# EAGLE design sensor (EAGLE 6.5.0)
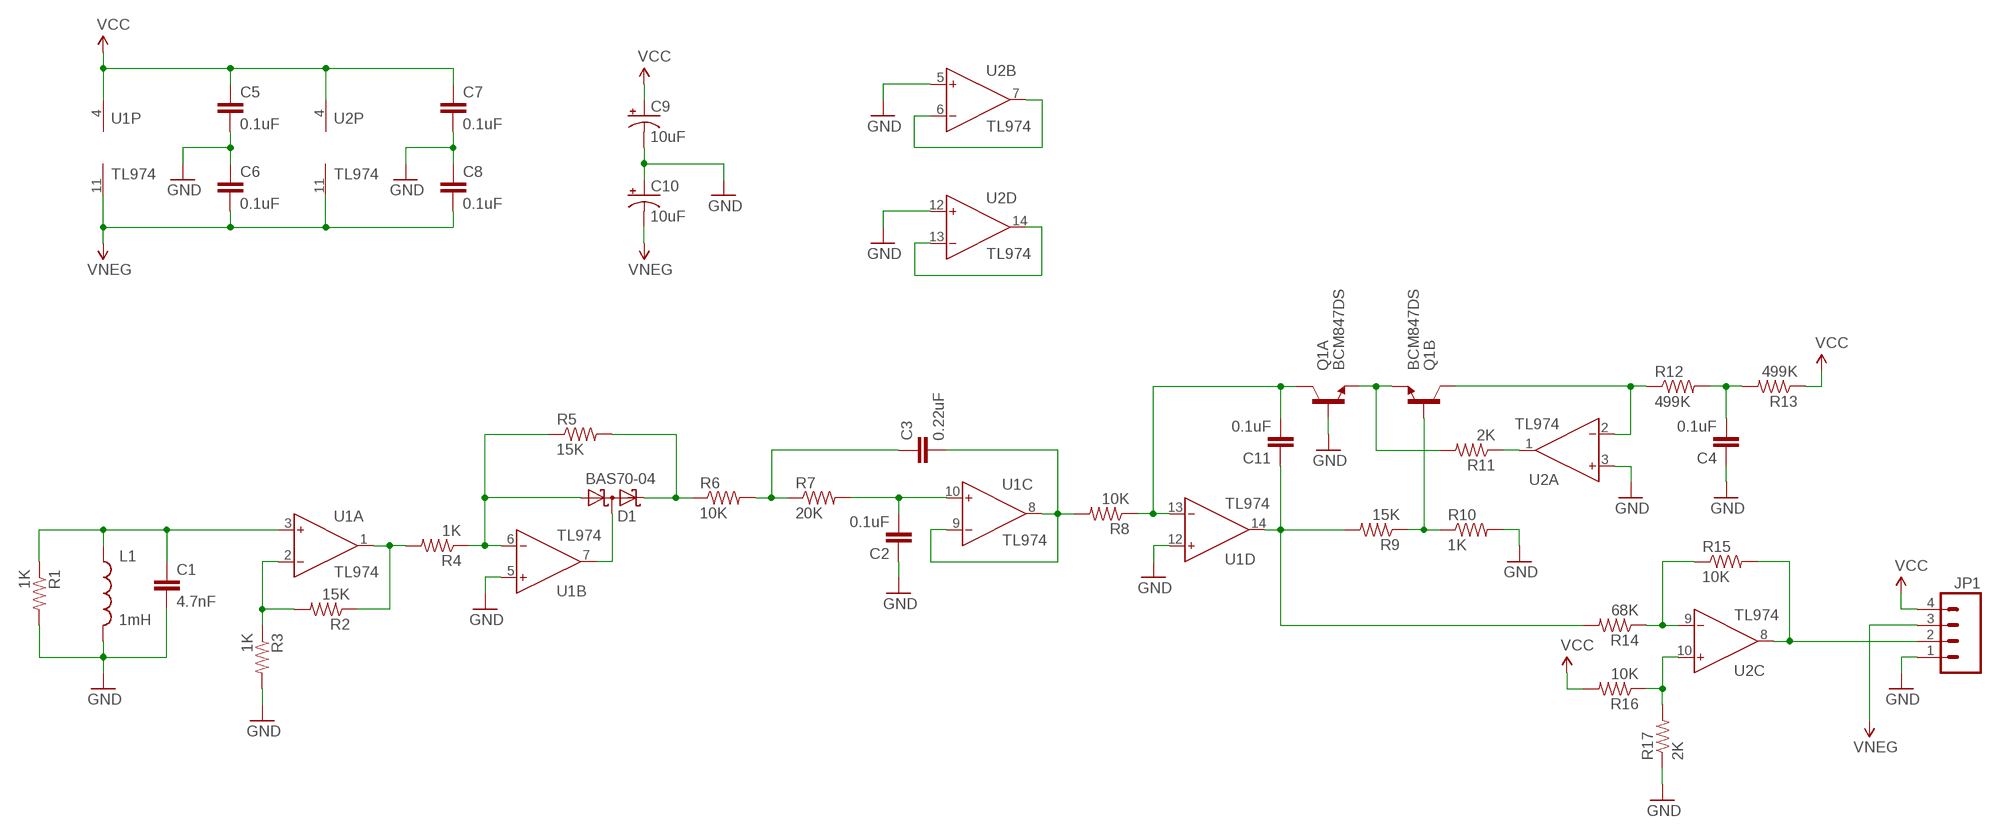
[diagram p0: schematic, sheet 1]

## Parts
C1  4.7nF  CAP0805  [0805]
C2  0.1uF  CAP0805  [0805]
C3  0.22uF  CAP0805  [0805]
C4  0.1uF  CAP0805  [0805]
C5  0.1uF  CAP0805  [0805]
C6  0.1uF  CAP0805  [0805]
C7  0.1uF  CAP0805  [0805]
C8  0.1uF  CAP0805  [0805]
C9  10uF  CPOL-USE2-4  [E2-4]
C10  10uF  CPOL-USE2-4  [E2-4]
C11  0.1uF  CAP0805  [0805]
D1  BAS70-04  [SOT23]
JP1  M04POLAR_LOCK  [MOLEX-1X4_LOCK]
L1  1mH  INDUCTORRLB0912  [RLB0912]
Q1  BCM847DS  [SOT-457]
R1  1K  RESISTOR0805-RES  [0805]
R2  15K  RESISTOR0805-RES  [0805]
R3  1K  RESISTOR0805-RES  [0805]
R4  1K  RESISTOR0805-RES  [0805]
R5  15K  RESISTOR0805-RES  [0805]
R6  10K  RESISTOR0805-RES  [0805]
R7  20K  RESISTOR0805-RES  [0805]
R8  10K  RESISTOR0805-RES  [0805]
R9  15K  RESISTOR0805-RES  [0805]
R10  1K  RESISTOR0805-RES  [0805]
R11  2K  RESISTOR0805-RES  [0805]
R12  499K  RESISTOR0805-RES  [0805]
R13  499K  RESISTOR0805-RES  [0805]
R14  68K  RESISTOR0805-RES  [0805]
R15  10K  RESISTOR0805-RES  [0805]
R16  10K  RESISTOR0805-RES  [0805]
R17  2K  RESISTOR0805-RES  [0805]
U1  TL974  [SOIC-14]
U2  TL974  [SOIC-14]

## Nets
GND: C1.2 C2.1 C4.1 C5.2 C6.1 C7.2 C8.1 C9.- C10.+ JP1.1 L1.2 Q1.2(A:B) R1.2 R3.2 R10.2 R17.1 U1.5(B:IN+) U1.12(D:IN+) U2.3(A:IN+) U2.5(B:IN+) U2.12(D:IN+)
N$1: C1.1 L1.1 R1.1 U1.3(A:IN+)
N$2: D1.1(A1) R4.1 R5.1 U1.6(B:IN-)
N$3: R2.2 R3.1 U1.2(A:IN-)
N$4: R2.1 R4.2 U1.1(A:OUT)
N$5: D1.2(C2) R5.2 R6.1
N$6: C2.2 R7.2 U1.10(C:IN+)
N$7: C3.1 R6.2 R7.1
N$8: D1.3(C1A2) U1.7(B:OUT)
N$9: U2.6(B:IN-) U2.7(B:OUT)
N$10: C3.2 R8.2 U1.8(C:OUT) U1.9(C:IN-)
N$11: U2.13(D:IN-) U2.14(D:OUT)
N$13: C11.2 Q1.6(A:C) R8.1 U1.13(D:IN-)
N$14: R11.1 U2.1(A:OUT)
N$15: Q1.1(A:E) Q1.4(B:E) R11.2
N$16: Q1.5(B:B) R9.1 R10.1
N$17: C11.1 R9.2 R14.2 U1.14(D:OUT)
N$18: C4.2 R12.2 R13.2
N$19: Q1.3(B:C) R12.1 U2.2(A:IN-)
N$20: R16.1 R17.2 U2.10(C:IN+)
N$22: R14.1 R15.1 U2.9(C:IN-)
N$24: JP1.2 R15.2 U2.8(C:OUT)
VCC: C5.1 C7.1 C9.+ JP1.4 R13.1 R16.2 U1.4(P:V+) U2.4(P:V+)
VNEG: C6.2 C8.2 C10.- JP1.3 U1.11(P:V-) U2.11(P:V-)

## Library data of the parts
C1-C8 C11 = SparkFun-Capacitors:CAP: Capacitor Standard 0603 ceramic capacitor, and 0.1" leaded capacitor.
C9 C10 = resistor:CPOL-US: POLARIZED CAPACITOR, American symbol
D1 = diode:BAS70-04: Silicon Schottky Diodes General-purpose diode for high-speed switching
JP1 = SparkFun-Connectors:M04: Header 4 Standard 4-pin 0.1" header. Use with straight break away headers (SKU : PRT-00116), right angle break away headers (PRT-00553), swiss pins (PRT-00743), machine pins (PRT-00117), and female headers (PRT-00115). Molex polarized connector foot print use with SKU : PRT-08231 with associated crimp pins and housings. 1MM SMD Version SKU: PRT-10208
L1 = SparkFun-Passives:INDUCTOR: Inductors Basic Inductor/Choke - 0603 and 1206. Footprints are not proven and vary greatly between part numbers. SRN6045- 33uH, 20% 1.4A SDR0403-560KL - 56uH, 10%, 500mA RMS/740mA peak
Q1 = Custom:BCM847DS: NPN/NPN matched double transistors
R1-R17 = SparkFun-Resistors:RESISTOR: Resistor Basic schematic elements and footprints for 0603, 1206, and PTH resistors.
U1 U2 = Custom:TL974: Quad Rail-to-Rail Very-Low-Noise Op Amp

## Board
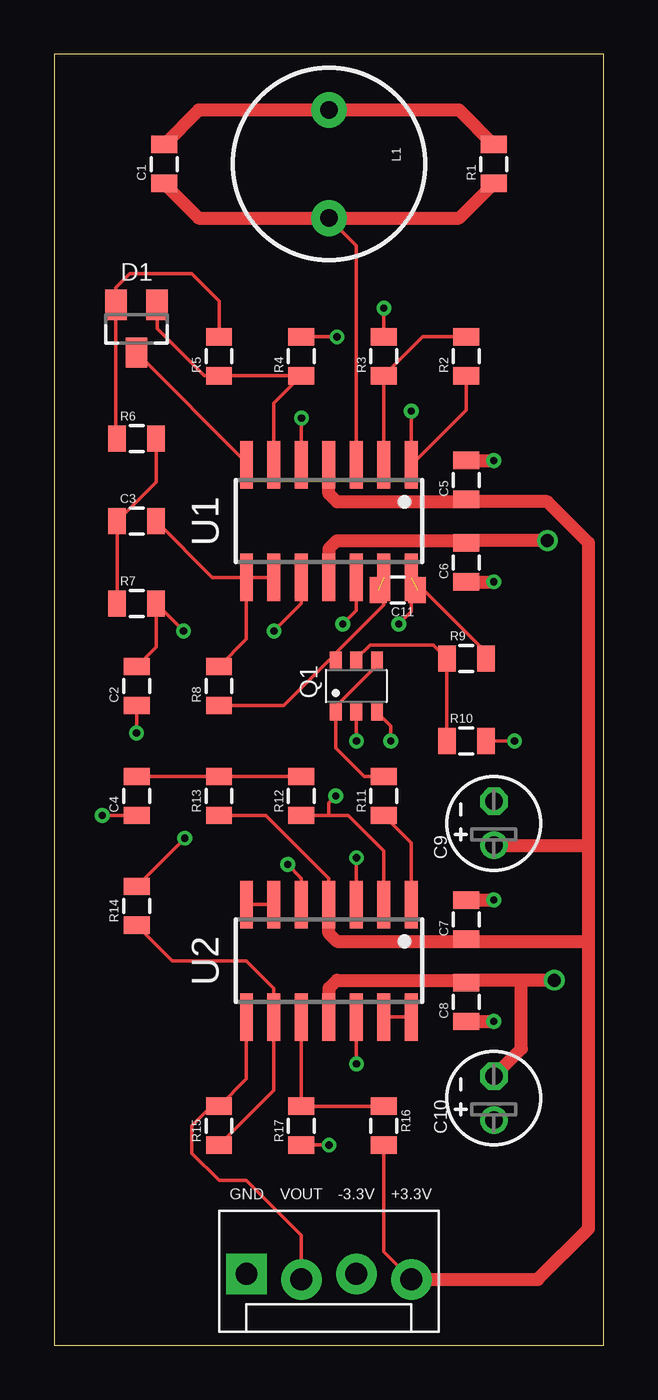
[diagram p1: board, top side]
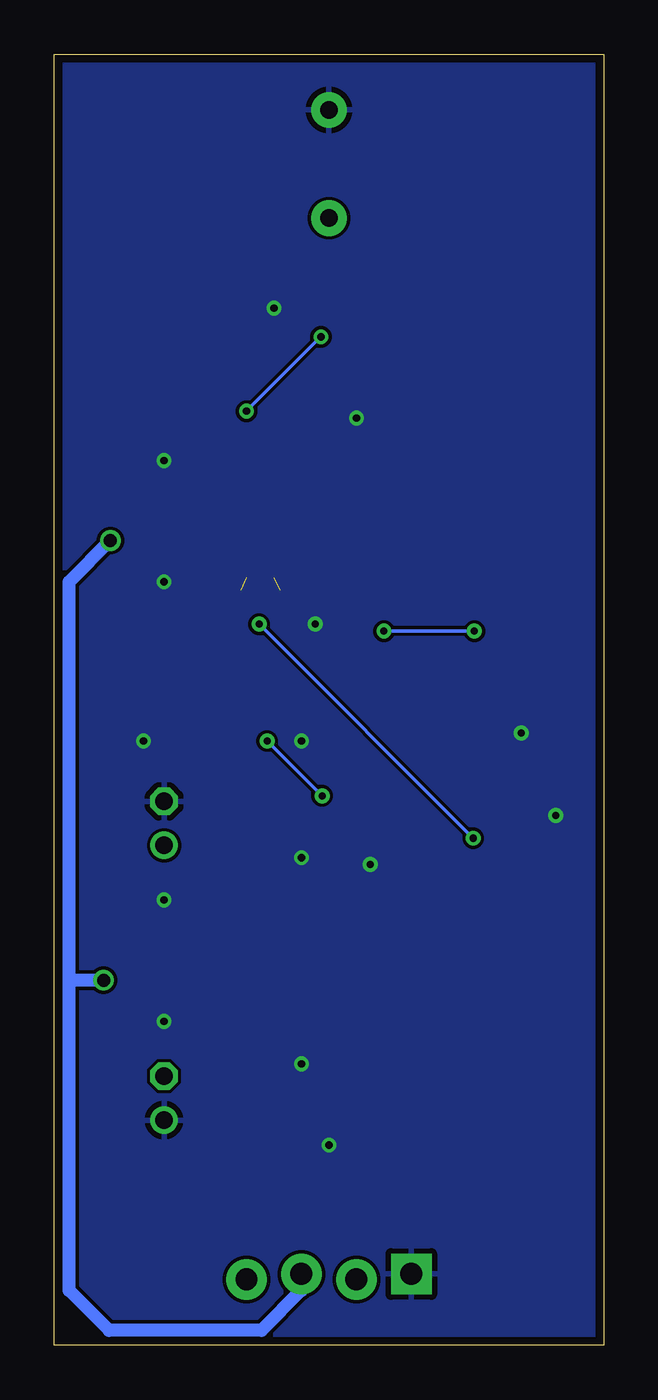
[diagram p2: board, bottom side, seen from below]

Size 25.4 x 59.69 mm. Coordinates in mm from the lower left corner, seen from the top.
Outline: 0,0 25.4,0 25.4,59.69 0,59.69 0,0
Copper layers (1*16): Top 0.0356mm / dielectric 1.5011mm / Bottom 0.0356mm
Design rules "LaenPCBOrder": minimum track width 6mil, minimum drill 13mil, track to track 6mil, track to pad 6mil, pad to pad 6mil, via to via 6mil, smd to smd 6mil, copper to edge 15mil, drill to drill 6mil, minimum pad ring 7mil, minimum via ring 7mil, stop-mask expansion 3mil, vias tented up to drill 0mil, thermal gap 10mil

### Footprints (pad centres in the part's own frame; a part is rotated, then mirrored left to right if it is on the bottom)
0805 = smd 0.8 x 1.2: 1 -0.9,0; 2 0.9,0
E2-4 = drill 0.813 pad 1.27: + -1.016,0 | drill 0.813 pad 1.27 octagon: - 1.016,0
SOT23 = smd 1 x 1.4: 1 -0.95,-1.1; 2 0.95,-1.1; 3 0,1.1
MOLEX-1X4_LOCK = drill 1.016 pad 1.88 square: 1 0,0.127 | drill 1.016 pad 1.88: 2 2.54,-0.127; 3 5.08,0.127; 4 7.62,-0.127
RLB0912 = drill 0.813 pad 1.651: 1 2.502,0; 2 -2.502,0
SOT-457 = smd 0.55 x 0.8: 1 -0.95,-1.2; 2 0,-1.2; 3 0.95,-1.2; 4 0.95,1.2; 5 0,1.2; 6 -0.95,1.2
SOIC-14 = smd 0.6 x 2.2: 1 -3.81,-2.6; 2 -2.54,-2.6; 3 -1.27,-2.6; 4 0,-2.6; 5 1.27,-2.6; 6 2.54,-2.6; 7 3.81,-2.6; 8 3.81,2.6; 9 2.54,2.6; 10 1.27,2.6; 11 0,2.6; 12 -1.27,2.6; 13 -2.54,2.6; 14 -3.81,2.6

### Placement (x,y rotation side)
C1  5.08,54.61 90 top
C2  3.81,30.48 90 top
C3  3.81,38.1 0 top
C4  3.81,25.4 90 top
C5  19.05,40.01 90 top
C6  19.05,36.2 90 top
C7  19.05,19.68 90 top
C8  19.05,15.88 90 top
C9  20.32,24.13 90 top
C10  20.32,11.43 90 top
C11  15.88,34.92 180 top
D1  3.81,46.99 180 top
JP1  8.89,3.17 0 top
L1  12.7,54.61 270 top
Q1  13.97,30.48 0 top
R1  20.32,54.61 90 top
R2  19.05,45.72 90 top
R3  15.24,45.72 90 top
R4  11.43,45.72 90 top
R5  7.62,45.72 90 top
R6  3.81,41.91 0 top
R7  3.81,34.29 0 top
R8  7.62,30.48 90 top
R9  19.05,31.75 0 top
R10  19.05,27.94 0 top
R11  15.24,25.4 90 top
R12  11.43,25.4 90 top
R13  7.62,25.4 90 top
R14  3.81,20.32 90 top
R15  7.62,10.16 90 top
R16  15.24,10.16 270 top
R17  11.43,10.16 90 top
U1  12.7,38.1 180 top
U2  12.7,17.78 180 top

### Tracks (layer width: path | path; a pad name or v marks a point on that pad's centre or on a via)
GND  (via drill 0.33)
  Top 0.152: R3.2 v15.24,47.94 | U1.5 v11.43,42.86 | C2.1 v3.81,28.31 | Q1.2 v13.97,27.94 | C4.1 v2.22,24.5 | U2.3 v13.97,22.54 | R17.1 v12.7,9.26 | U1.12 13.97,33.97 v13.34,33.34 | U2.12 v13.97,13.02 | U2.5 11.43,21.59 v10.79,22.23 | R10.2 v21.27,27.94
  Top 0.61: C1.2 6.68,57.11 L1.2 18.72,57.11 R1.2 | C5.2 v20.32,40.91 | C6.1 v20.32,35.3 | C7.2 v20.32,20.59 | C8.1 v20.32,14.97
  pour Bottom: 0,0 25.4,0 25.4,59.69 0,59.69
N$1
  Top 0.152: L1.1 13.97,50.84 U1.3
  Top 0.61: C1.1 6.68,52.11 L1.1 18.72,52.11 R1.1
N$2
  Top 0.152: U1.6 10.16,43.55 R4.1 R5.1 6.93,44.82 4.76,46.99 D1.1
N$3
  Top 0.152: U1.2 R3.1 17.04,46.62 R2.2
N$4  (via drill 0.33)
  Top 0.152: v16.51,43.18 U1.1 19.05,43.24 R2.1 | v13.07,46.62 R4.2
  Bottom 0.152: v16.51,43.18 v13.07,46.62
N$5
  Top 0.152: R6.1 2.86,41.96 D1.2 2.86,48.9 3.49,49.53 6.35,49.53 7.62,48.26 R5.2
N$6  (via drill 0.33)
  Top 0.152: C2.2 4.71,32.28 R7.2 v5.98,33.02 | v10.16,33.02 11.43,34.29 U1.10
  Bottom 0.152: v5.98,33.02 v10.16,33.02
N$7
  Top 0.152: R6.2 4.71,39.9 C3.1 R7.1
N$8
  Top 0.152: 3.7,45.89 D1.3 8.89,40.81 U1.7
N$9
  Top 0.152: U2.7 U2.6
N$10
  Top 0.152: C3.2 7.31,35.5 U1.8 | U1.8 U1.9 | R8.2 8.89,32.65 U1.8
N$11
  Top 0.152: U2.13 U2.14
N$13  (1 unrouted)
  Top 0.152: R8.1 10.6,29.58 12.7,31.68 Q1.6 13.02,32 15.24,34.22 U1.13
N$14
  Top 0.152: R11.1 16.51,23.23 U2.1
N$15
  Top 0.152: R11.2 14.34,26.3 13.02,27.62 Q1.1 13.02,29.53 14.92,31.43 Q1.4
N$16
  Top 0.152: Q1.5 13.97,31.75 14.61,32.38 17.52,32.38 R9.1 R10.1
N$17  (via drill 0.33)  (1 unrouted)
  Top 0.152: R9.2 19.95,32.06 U1.14 16.51,33.92 v15.93,33.34 | v6.03,23.44 R14.2
  Bottom 0.152: v15.93,33.34 v6.03,23.44
N$18
  Top 0.152: R12.2 R13.2 C4.2
N$19  (via drill 0.33)
  Top 0.152: R12.1 12.7,24.5 | 12.7,24.5 13.6,24.5 15.24,22.86 U2.2 | Q1.3 15.56,28.64 v15.56,27.94 | v13.02,25.4 12.7,25.08 12.7,24.5
  Bottom 0.152: v15.56,27.94 v13.02,25.4
N$20
  Top 0.152: R16.1 R17.2 U2.10
N$22
  Top 0.152: R14.1 5.45,17.78 8.89,17.78 10.16,16.51 U2.9 10.16,11.8 R15.1
N$24
  Top 0.152: JP1.2 11.43,5.08 8.89,7.62 7.62,7.62 6.35,8.89 6.35,10.16 7.25,11.06 R15.2 8.89,12.33 U2.8
VCC
  Top 0.152: R13.1 9.79,24.5 12.7,21.59 U2.4 | R16.2 15.24,4.32 JP1.4
  Top 0.61: 24.7,18.68 24.7,5.4 22.35,3.05 JP1.4 | 24.7,18.68 24.7,23.11 | 24.7,23.11 24.7,37.09 22.8,39 19.05,39 | U2.4 12.7,19.05 13.07,18.68 19.05,18.68 | U1.4 12.7,39.37 13.07,39 19.05,39 | 19.05,39 C5.1 | 19.05,18.68 C7.1 | 19.05,18.68 24.7,18.68 | C9.+ 24.7,23.11
VNEG  (via drill 0.6)
  Top 0.61: U2.11 12.7,16.51 13.07,16.88 19.05,16.88 | U1.11 12.7,36.83 13.07,37.2 19.05,37.2 | v22.8,37.2 19.05,37.2 | 19.05,37.2 C6.2 | v23.11,16.88 21.59,16.88 | 21.59,16.88 19.05,16.88 | 19.05,16.88 C8.2 | 21.59,16.88 21.59,13.72 C10.-
  Bottom 0.61: 24.7,16.88 24.7,2.54 22.86,0.7 15.81,0.7 13.97,2.54 JP1.3 | 24.7,16.88 24.7,35.3 v22.8,37.2 | v23.11,16.88 24.7,16.88

### Text on the board
tPlace: GND | VOUT | -3.3V | +3.3V